# EAGLE design sdcard (EAGLE 9.2.2)
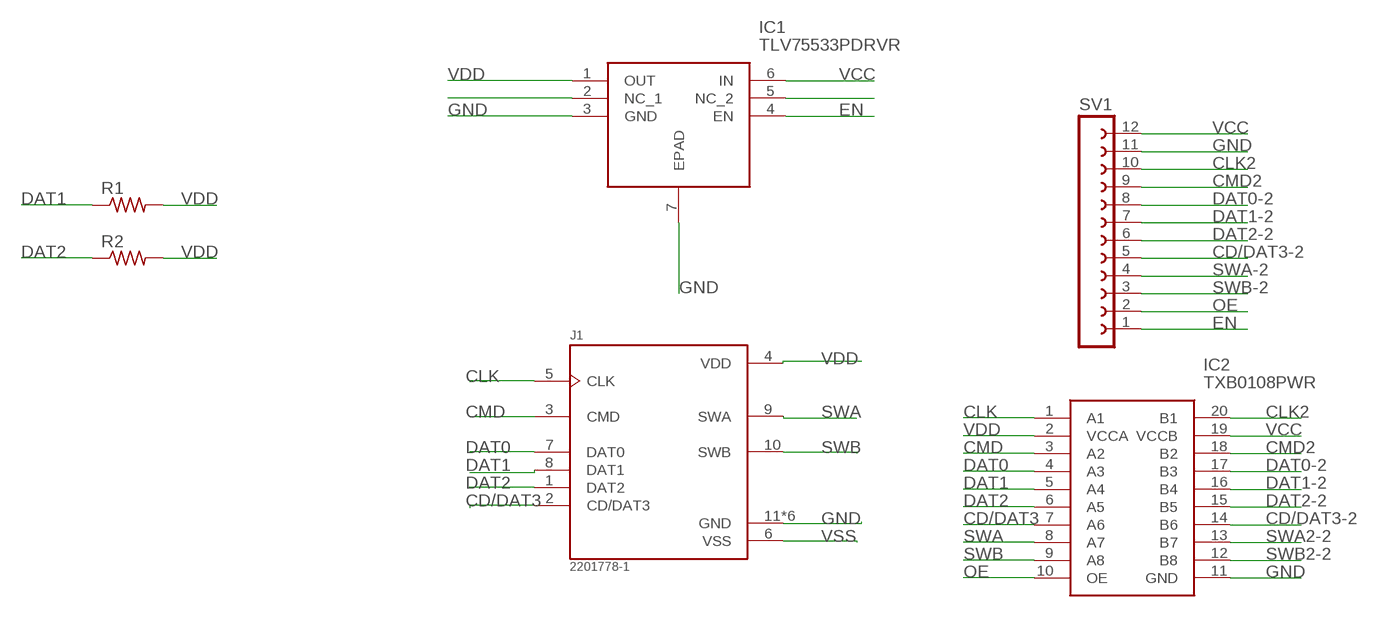
[diagram p0: schematic, sheet 1]

## Parts
IC1  TLV75533PDRVR  [SON65P200X200X80-7N]
IC2  TXB0108PWR  [SOP65P640X120-20N]
J1  2201778-1  [TE_2201778-1]
R1  R-US_R0603  [R0603]
R2  R-US_R0603  [R0603]
SV1  FE12-1  [FE12]

## Nets
CD/DAT3: IC2.7(A6) J1.2(CD/DAT3)
CD/DAT3-2: IC2.14(B6) SV1.5
CLK: IC2.1(A1) J1.5(CLK)
CLK2: IC2.20(B1) SV1.10
CMD: IC2.3(A2) J1.3(CMD)
CMD2: IC2.18(B2) SV1.9
DAT0: IC2.4(A3) J1.7(DAT0)
DAT0-2: IC2.17(B3) SV1.8
DAT1: IC2.5(A4) J1.8(DAT1) R1.1
DAT1-2: IC2.16(B4) SV1.7
DAT2: IC2.6(A5) J1.1(DAT2) R2.1
DAT2-2: IC2.15(B5) SV1.6
EN: IC1.4(EN) SV1.1
GND: IC1.3(GND) IC1.7(EPAD) IC2.11(GND) J1.11(GND) J1.12(GND) J1.13(GND) J1.14(GND) J1.15(GND) J1.16(GND) SV1.11
N$10: IC1.2(NC_1)
N$14: IC1.5(NC_2)
OE: IC2.10(OE) SV1.2
SWA: IC2.8(A7) J1.9(SWA)
SWA2-2: IC2.13(B7)
SWA-2: SV1.4
SWB: IC2.9(A8) J1.10(SWB)
SWB2-2: IC2.12(B8)
SWB-2: SV1.3
VCC: IC1.6(IN) IC2.19(VCCB) SV1.12
VDD: IC1.1(OUT) IC2.2(VCCA) J1.4(VDD) R1.2 R2.2
VSS: J1.6(VSS)

## Library data of the parts
IC1 = TLV75533PDRVR:TLV75533PDRVR: 500-mA low-IQ small-size low-dropout (LDO) regulator Source: Datasheet <http://www.ti.com/lit/gpn/tlv755p>; DESCRIPTION: 500-mA low-IQ small-size low-dropout (LDO) regulator; HEIGHT: 0.8mm; MANUFACTURER_NAME: Texas Instruments; MANUFACTURER_PART_NUMBER: TLV75533PDRVR; MOUSER_PART_NUMBER: 595-TLV75533PDRVR; MOUSER_PRICE-STOCK: https://www.mouser.com/Search/Refine.aspx?Keyword=595-TLV75533PDRVR
IC2 = TXB0108PWR:TXB0108PWR: 8-Bit Bidirectional Voltage-Level Shifter with Auto Direction Sensing and +/-15-kV ESD Protect Source: Datasheet <http://www.ti.com/lit/ds/symlink/txb0108.pdf>; DESCRIPTION: 8-Bit Bidirectional Voltage-Level Shifter with Auto Direction Sensing and +/-15-kV ESD Protect; HEIGHT: 1.2mm; MANUFACTURER_NAME: Texas Instruments; MANUFACTURER_PART_NUMBER: TXB0108PWR; MOUSER_PART_NUMBER: 595-TXB0108PWR; MOUSER_PRICE-STOCK: https://www.mouser.com/Search/Refine.aspx?Keyword=595-TXB0108PWR; RS_PART_NUMBER: 7094614P; RS_PRICE-STOCK: http://uk.rs-online.com/web/p/products/7094614P
J1 = 2201778-1 (2):2201778-1: MICRO SD PUSH PUSH LOW PROFILE TYPE; AVAILABILITY: Unavailable; CENTERLINE_PITCH: 1.1 mm[.04 in]; COMMENT: 2201778-1; DESCRIPTION: MICRO SD PUSH PUSH LOW PROFILE TYPE; EU_ROHS_COMPLIANCE: Compliant; MF: TE Connectivity; MP: 2201778-1; NUMBER_OF_POSITIONS: 8; PACKAGE: None; PRICE: None; PRODUCT_TYPE: Removable Memory Products; TE_PURCHASE_URL: https://www.te.com/usa-en/product-2201778-1.html?te_bu=Cor&te_type=disp&te_campaign=seda_glo_cor-seda-global-disp-prtnr-fy19-seda-model-bom-cta_sma-317_1&elqCampaignId=32493
R1 R2 = rcl:R-US_: RESISTOR, American symbol; SPICEPREFIX: R
SV1 = con-lsta:FE12-1: FEMALE HEADER; OC_FARNELL: unknown; OC_NEWARK: unknown

## Board
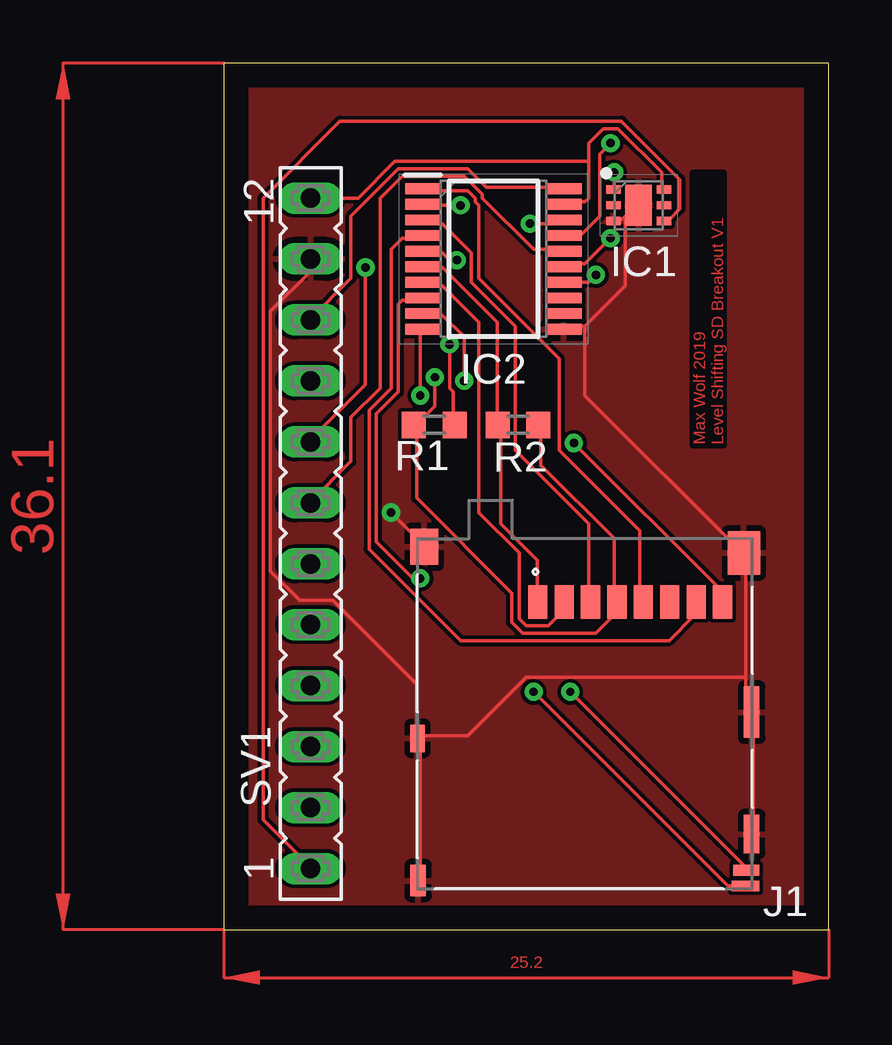
[diagram p1: board, top side]
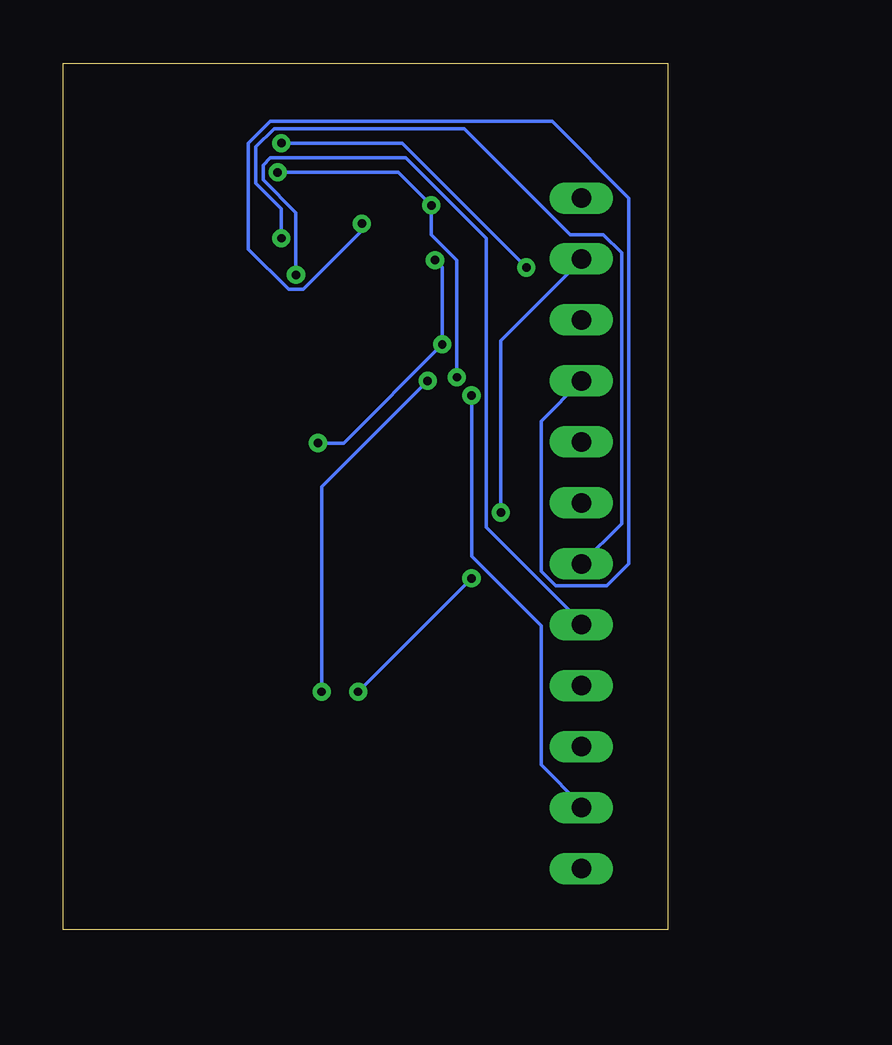
[diagram p2: board, bottom side, seen from below]

Size 25.2 x 36.1 mm. Coordinates in mm from the lower left corner, seen from the top.
Outline: 0,0 25.2,0 25.2,36.1 0,36.1 0,0
Copper layers (1*16): Top 0.035mm / dielectric 1.5mm / Bottom 0.035mm
Design rules "default": minimum track width 6mil, minimum drill 0.35mm, track to track 6mil, track to pad 6mil, pad to pad 6mil, via to via 6mil, smd to smd 6mil, copper to edge 40mil, drill to drill 6mil, minimum pad ring 10mil, minimum via ring 8mil, stop-mask expansion 4mil, vias tented up to drill 0mil, thermal gap 10mil

### Footprints (pad centres in the part's own frame; a part is rotated, then mirrored left to right if it is on the bottom)
SON65P200X200X80-7N = smd 0.6 x 0.35: 1 -1.05,0.65; 2 -1.05,0; 3 -1.05,-0.65; 4 1.05,-0.65; 5 1.05,0; 6 1.05,0.65 | smd 1.1 x 1.7: 7 0,0
SOP65P640X120-20N = smd 1.475 x 0.45: 1 -2.938,2.925; 2 -2.938,2.275; 3 -2.938,1.625; 4 -2.938,0.975; 5 -2.938,0.325; 6 -2.938,-0.325; 7 -2.938,-0.975; 8 -2.938,-1.625; 9 -2.938,-2.275; 10 -2.938,-2.925; 11 2.938,-2.925; 12 2.938,-2.275; 13 2.938,-1.625; 14 2.938,-0.975; 15 2.938,-0.325; 16 2.938,0.325; 17 2.938,0.975; 18 2.938,1.625; 19 2.938,2.275; 20 2.938,2.925
TE_2201778-1 = smd 0.8 x 1.4: 1 1.965,-4.75; 2 0.865,-4.75; 3 -0.235,-4.75; 4 -1.335,-4.75; 5 -2.435,-4.75; 6 -3.535,-4.75; 7 -4.635,-4.75; 8 -5.735,-4.75 | smd 1.15 x 0.45: 9 -6.7,7.075 | smd 1.1 x 0.45: 10 -6.725,6.415 | smd 1.35 x 1.8: 11 -6.625,-6.8 | smd 0.65 x 2.14: 12 -6.95,-0.17 | smd 0.65 x 1.6: 13 -6.95,4.91 | smd 0.65 x 1.3: 14 6.95,6.85 | smd 0.6 x 1.15: 15 6.975,0.925 | smd 1.16 x 1.5: 16 6.695,-7.05
R0603 = smd 1 x 1.1: 1 -0.85,0; 2 0.85,0
FE12 = drill 0.813 long: 1 -13.97,0; 2 -11.43,0; 3 -8.89,0; 4 -6.35,0; 5 -3.81,0; 6 -1.27,0; 7 1.27,0; 8 3.81,0; 9 6.35,0; 10 8.89,0; 11 11.43,0; 12 13.97,0

### Placement (x,y rotation side)
IC1  17.28,30.18 0 top
IC2  11.23,27.94 0 top
J1  15.04,8.89 180 top
R1  8.76,21.03 180 top
R2  12.25,21.03 0 top
SV1  3.61,16.51 90 top

### Tracks (layer width: path | path; a pad name or v marks a point on that pad's centre or on a via)
CD/DAT3
  Top 0.152: J1.2 14.13,13.56 14.13,13.26 13.52,12.65 12.6,12.65 12.3,12.95 12.3,15.7 10.62,17.37 10.62,25.3 9.1,26.82 8.33,26.82 IC2.7
CD/DAT3-2  (via drill 0.35)
  Top 0.152: v15.5,27.28 15.19,26.98 14.28,26.98 IC2.14
  Bottom 0.152: v15.5,27.28 15.5,29.87 16.87,31.24 16.87,31.85 16.56,32.16 10.93,32.16 7.57,28.8 7.57,16.76 3.61,12.8 SV1.5
CLK
  Top 0.152: J1.5 17.33,13.72 17.33,16.61 13.97,19.96 13.97,23.77 10.62,27.13 10.62,30.18 10.47,30.33 10.47,30.48 10.16,30.79 8.33,30.79 IC2.1
CLK2
  Top 0.152: IC2.20 14.13,30.94 10.93,30.94 10.16,31.7 7.27,31.7 5.29,29.72 5.29,27.13 3.61,25.45 SV1.10
CMD
  Top 0.152: J1.3 15.19,13.72 15.19,16.92 12.14,19.96 12.14,25.15 10.32,26.98 10.32,28.19 9.1,29.41 8.33,29.41 IC2.3
CMD2  (via drill 0.35)
  Top 0.152: v12.75,29.41 14.13,29.41 IC2.18
  Bottom 0.152: v12.75,29.41 12.75,29.11 15.19,26.67 15.8,26.67 17.48,28.35 17.48,32.77 16.56,33.68 4.83,33.68 1.63,30.48 1.63,15.24 2.54,14.33 4.68,14.33 5.29,14.94 5.29,21.18 SV1.9
DAT0
  Top 0.152: J1.7 19.61,13.56 19.61,13.11 18.55,12.04 9.86,12.04 6.05,15.85 6.05,21.64 6.96,22.55 6.96,28.35 7.42,28.8 8.18,28.8 IC2.4
DAT0-2  (via drill 0.35)
  Top 0.152: v16.11,32.77 15.65,32.31 15.65,29.72 14.89,28.96 14.28,28.96 IC2.17 | v5.9,27.58 5.9,22.71 3.61,20.42 SV1.8
  Bottom 0.152: v16.11,32.77 11.08,32.77 v5.9,27.58
DAT1  (via drill 0.35)
  Top 0.152: v9.4,24.38 9.4,22.55 9.55,22.4 9.55,21.03 R1.1 | v9.71,27.89 9.4,27.89 9.1,28.19 8.33,28.19 IC2.5 | v14.58,20.27 20.68,14.17 20.68,13.72 J1.8
  Bottom 0.152: v9.71,27.89 9.4,27.58 v9.4,24.38 13.52,20.27 v14.58,20.27
DAT1-2
  Top 0.152: IC2.16 14.13,28.35 12.91,28.35 10.77,30.48 10.77,30.63 10.01,31.39 7.42,31.39 6.51,30.48 6.51,22.55 5.29,21.34 5.29,19.51 3.61,17.83 SV1.7
DAT2
  Top 0.152: J1.1 13.06,13.72 13.06,15.39 11.54,16.92 11.54,20.88 R2.1 11.38,21.03 11.38,25.3 9.1,27.58 8.33,27.58 IC2.6
DAT2-2  (via drill 0.35)
  Top 0.152: v16.11,28.8 15.04,27.74 14.28,27.74 IC2.15
  Bottom 0.152: v16.11,28.8 16.11,30.02 17.17,31.09 17.17,32.61 16.41,33.38 8.49,33.38 4.07,28.96 2.7,28.96 1.93,28.19 1.93,16.92 SV1.6
EN
  Top 0.152: IC1.4 18.39,29.57 18.55,29.57 19,30.02 19,31.24 16.56,33.68 4.83,33.68 1.63,30.48 1.63,4.57 3.61,2.59 SV1.1
GND  (via drill 0.35)
  Top 0.152: v6.96,17.37 8.33,16 J1.16 | 16.72,29.72 17.17,30.18 IC1.7 | 16.72,29.72 16.56,29.57 16.26,29.57 IC1.3 | 15.04,25.15 14.28,25.15 IC2.11 | 15.04,25.15 16.72,26.82 16.72,29.72 | J1.15 8.18,7.92 8.18,2.13 J1.14 | J1.13 22.05,4.12 22.05,8.99 J1.12 21.9,9.14 21.75,9.3 21.75,10.52 | 21.75,10.52 21.75,15.54 J1.11 21.59,15.7 15.04,22.25 15.04,25.15 | 21.75,10.52 12.6,10.52 10.16,8.08 8.18,8.08 J1.15 | SV1.11 3.61,27.43 1.93,25.76 1.93,14.94 3.15,13.72 4.52,13.72 8.03,10.21 8.03,8.08 J1.15
  Bottom 0.152: v6.96,17.37 6.96,24.54 3.61,27.89 SV1.11
  pour Top: 0,36.1 0,0 25.2,0 25.2,36.1
OE  (via drill 0.35)
  Top 0.152: v8.18,22.25 8.18,24.99 IC2.10
  Bottom 0.152: v8.18,22.25 8.18,15.54 5.29,12.65 5.29,6.86 3.61,5.18 SV1.2
SWA  (via drill 0.35)
  Top 0.152: v12.91,9.91 20.98,1.83 21.59,1.83 J1.9 | v8.18,14.63 7.88,14.63 6.35,16.15 6.35,21.49 7.27,22.4 7.27,26.06 7.42,26.21 8.18,26.21 IC2.8
  Bottom 0.152: v8.18,14.63 v12.91,9.91
SWB  (via drill 0.35)
  Top 0.152: v14.43,9.91 21.75,2.59 J1.10 | v10.01,22.86 10.01,24.69 9.1,25.6 8.33,25.6 IC2.9
  Bottom 0.152: v14.43,9.91 14.43,18.44 v10.01,22.86
VCC
  Top 0.152: 15.19,32 15.19,30.48 15.04,30.33 14.28,30.33 IC2.19 | 15.19,32 15.19,32.77 15.8,33.38 16.41,33.38 18.24,31.55 18.24,30.94 IC1.6 | SV1.12 5.59,30.48 7.12,32 15.19,32
VDD  (via drill 0.35)
  Top 0.152: v16.26,31.55 16.26,30.94 IC1.1 | v9.86,30.18 8.33,30.18 IC2.2 | R2.2 13.21,20.88 13.21,19.36 16.26,16.31 16.26,13.72 J1.4 16.26,13.56 16.26,13.11 15.5,12.34 12.45,12.34 11.99,12.8 11.99,14.02 8.03,17.98 8.03,20.88 R1.2 8.03,21.03 8.79,21.79 v8.79,23.01
  Bottom 0.152: v16.26,31.55 11.23,31.55 v9.86,30.18 9.86,28.96 8.79,27.89 v8.79,23.01
(copper drawn outside any net)
  shapes: Top area x2

### Text on the board
Top: Max Wolf 2019 / Level Shifting SD Breakout V1